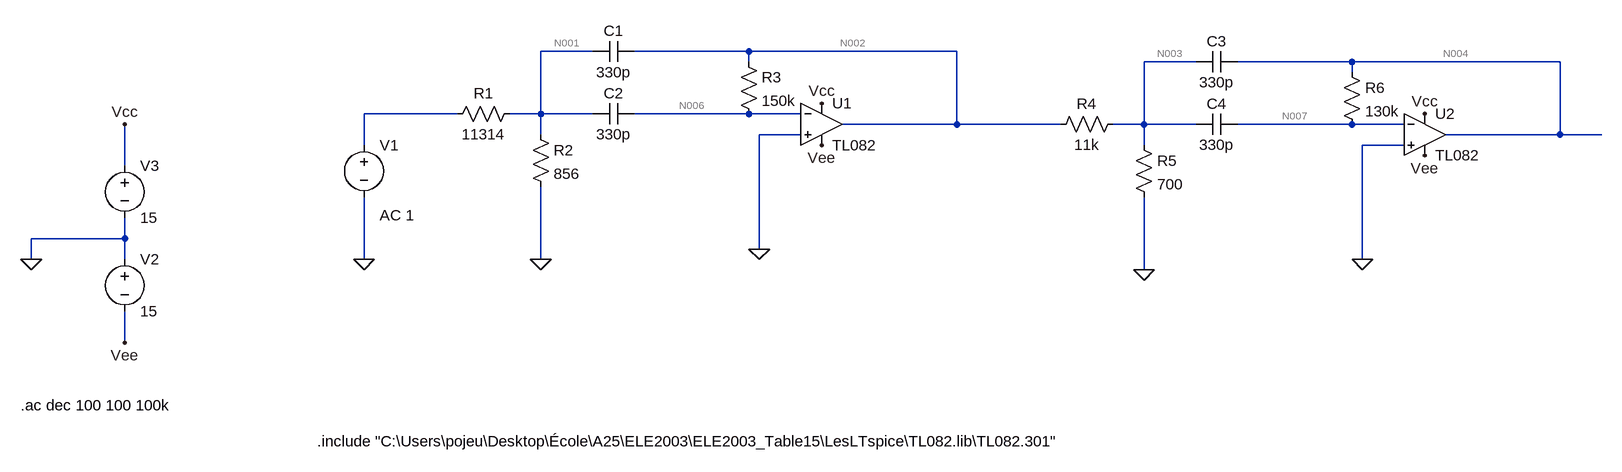
[diagram p0: schematic Draft2.asc]
Draft2.asc, the LTspice schematic file:
Version 4.1
SHEET 1 2256 680
WIRE 224 -192 144 -192
WIRE 464 -192 288 -192
WIRE 784 -192 464 -192
WIRE 464 -176 464 -192
WIRE 1152 -176 1072 -176
WIRE 1392 -176 1216 -176
WIRE 1712 -176 1392 -176
WIRE 1392 -160 1392 -176
WIRE 16 -96 -128 -96
WIRE 144 -96 144 -192
WIRE 144 -96 96 -96
WIRE 224 -96 144 -96
WIRE 464 -96 288 -96
WIRE 544 -96 464 -96
WIRE 784 -80 784 -192
WIRE 784 -80 608 -80
WIRE 944 -80 784 -80
WIRE 1072 -80 1072 -176
WIRE 1072 -80 1024 -80
WIRE 1152 -80 1072 -80
WIRE 1392 -80 1216 -80
WIRE 1472 -80 1392 -80
WIRE 144 -64 144 -96
WIRE 544 -64 480 -64
WIRE 1712 -64 1712 -176
WIRE 1712 -64 1536 -64
WIRE 1776 -64 1712 -64
WIRE -128 -48 -128 -96
WIRE 1072 -48 1072 -80
WIRE 1472 -48 1408 -48
WIRE -496 -16 -496 -80
WIRE -496 96 -496 64
WIRE -496 96 -640 96
WIRE 480 112 480 -64
WIRE -640 128 -640 96
WIRE -496 128 -496 96
WIRE -128 128 -128 32
WIRE 144 128 144 16
WIRE 1408 128 1408 -48
WIRE 1072 144 1072 32
WIRE -496 256 -496 208
FLAG 144 128 0
FLAG 576 -48 Vee
FLAG 576 -112 Vcc
FLAG -128 128 0
FLAG 480 112 0
FLAG -496 256 Vee
FLAG -496 -80 Vcc
FLAG -640 128 0
FLAG 1072 144 0
FLAG 1504 -32 Vee
FLAG 1504 -96 Vcc
FLAG 1408 128 0
DATAFLAG 1744 -64 ""
SYMBOL res 0 -80 R270
WINDOW 0 32 56 VTop 2
WINDOW 3 0 56 VBottom 2
SYMATTR InstName R1
SYMATTR Value 11314
SYMBOL res 128 -80 R0
SYMATTR InstName R2
SYMATTR Value 856
SYMBOL cap 288 -208 R90
WINDOW 0 0 32 VBottom 2
WINDOW 3 32 32 VTop 2
SYMATTR InstName C1
SYMATTR Value 330p
SYMBOL cap 288 -112 R90
WINDOW 0 0 32 VBottom 2
WINDOW 3 32 32 VTop 2
SYMATTR InstName C2
SYMATTR Value 330p
SYMBOL res 448 -192 R0
SYMATTR InstName R3
SYMATTR Value 150k
SYMBOL OpAmps\\opamp2 576 -144 R0
SYMATTR InstName U1
SYMATTR Value TL082
SYMBOL voltage -128 -64 R0
WINDOW 123 24 124 Left 2
WINDOW 39 0 0 Left 0
SYMATTR InstName V1
SYMATTR Value ""
SYMATTR Value2 AC 1
SYMBOL voltage -496 112 R0
SYMATTR InstName V2
SYMATTR Value 15
SYMBOL voltage -496 -32 R0
SYMATTR InstName V3
SYMATTR Value 15
SYMBOL res 928 -64 R270
WINDOW 0 32 56 VTop 2
WINDOW 3 0 56 VBottom 2
SYMATTR InstName R4
SYMATTR Value 11k
SYMBOL res 1056 -64 R0
SYMATTR InstName R5
SYMATTR Value 700
SYMBOL cap 1216 -192 R90
WINDOW 0 0 32 VBottom 2
WINDOW 3 32 32 VTop 2
SYMATTR InstName C3
SYMATTR Value 330p
SYMBOL cap 1216 -96 R90
WINDOW 0 0 32 VBottom 2
WINDOW 3 32 32 VTop 2
SYMATTR InstName C4
SYMATTR Value 330p
SYMBOL res 1376 -176 R0
SYMATTR InstName R6
SYMATTR Value 130k
SYMBOL OpAmps\\opamp2 1504 -128 R0
SYMATTR InstName U2
SYMATTR Value TL082
TEXT -656 352 Left 2 !.ac dec 100 100 100k
TEXT -200 408 Left 2 !.include "C:\\Users\\pojeu\\Desktop\\École\\A25\\ELE2003\\ELE2003_Table15\\LesLTspice\\TL082.lib\\TL082.301"

The netlist it stands for:
* Draft2.asc
R1 N005 N001 11314
R2 N001 0 856
C1 N002 N001 330p
C2 N006 N001 330p
R3 N002 N006 150k
X§U1 0 N006 Vcc Vee N002 TL082  ; pins In+ In- V+ V- OUT
V1 N005 0 AC 1
V2 0 Vee 15
V3 Vcc 0 15
R4 N002 N003 11k
R5 N003 0 700
C3 N004 N003 330p
C4 N007 N003 330p
R6 N004 N007 130k
X§U2 0 N007 Vcc Vee N004 TL082  ; pins In+ In- V+ V- OUT
.ac dec 100 100 100k
.include "C:\Users\pojeu\Desktop\École\A25\ELE2003\ELE2003_Table15\LesLTspice\TL082.lib\TL082.301"
.backanno
.end

* Results of the author's LTspice run, read from the files saved beside the schematic
* Operating Point, zero values left out:
*   V(n006) = 10.97 µV
*   V(vcc) = 15 V
*   V(n003) = 1.061 µV
*   V(n002) = 17.73 µV
*   V(vee) = -15 V
*   V(n004) = 16.83 µV
*   V(n007) = 10.97 µV
*   I(R3) = 45.05 pA
*   I(R4) = 1.515 nA
*   I(V2) = -28.39 mA
*   I(R5) = 1.515 nA
*   I(R6) = 45.05 pA
*   I(V3) = -28.39 mA
*   Ix(u2:1) = 45.05 pA
*   Ix(u2:2) = 45.05 pA
*   Ix(u2:3) = 14.19 mA
*   Ix(u2:4) = -14.19 mA
*   Ix(u2:5) = -45.05 pA
*   Ix(u1:1) = 45.05 pA
*   Ix(u1:2) = 45.05 pA
*   Ix(u1:3) = 14.19 mA
*   Ix(u1:4) = -14.19 mA
*   Ix(u1:5) = -1.56 nA
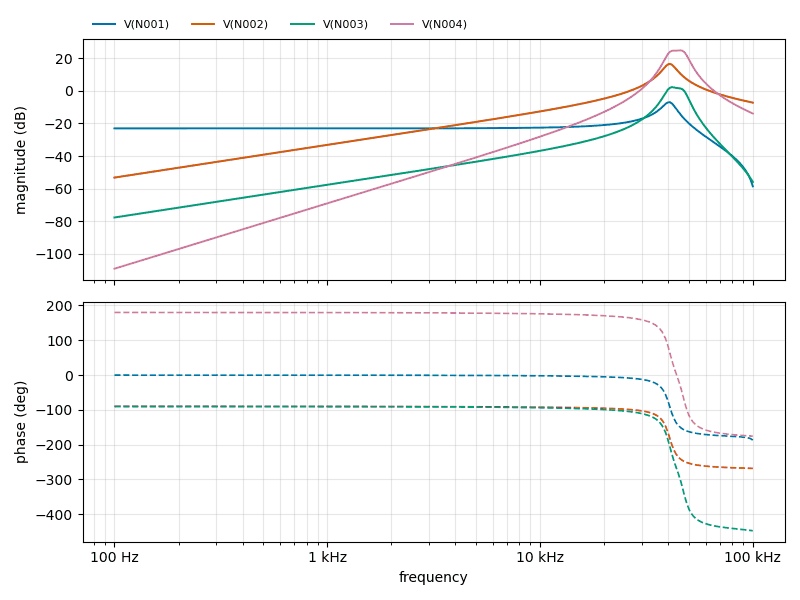
[diagram p1: AC Analysis of Draft2.asc, plotted from the saved traces]
* AC Analysis, 1 run:
*   V(N001): -23.06 dB at 100 Hz, -58.61 dB at 100 kHz, peak -6.99 dB at 40.74 kHz, 3 dB below the peak at 37.49 kHz and 43.03 kHz
*   V(N002): -53.20 dB at 100 Hz, -7.27 dB at 100 kHz, peak 16.50 dB at 40.74 kHz, 3 dB below the peak at 38.05 kHz and 43.47 kHz
*   V(N003): -77.66 dB at 100 Hz, -55.85 dB at 100 kHz, peak 2.21 dB at 41.69 kHz, 3 dB below the peak at 39.15 kHz and 48.01 kHz
*   V(N004): -109.05 dB at 100 Hz, -13.93 dB at 100 kHz, peak 24.77 dB at 45.71 kHz, 3 dB below the peak at 39.56 kHz and 48.8 kHz